# EAGLE design RadioAdapterBoardV4_0 (EAGLE 7.7.0)
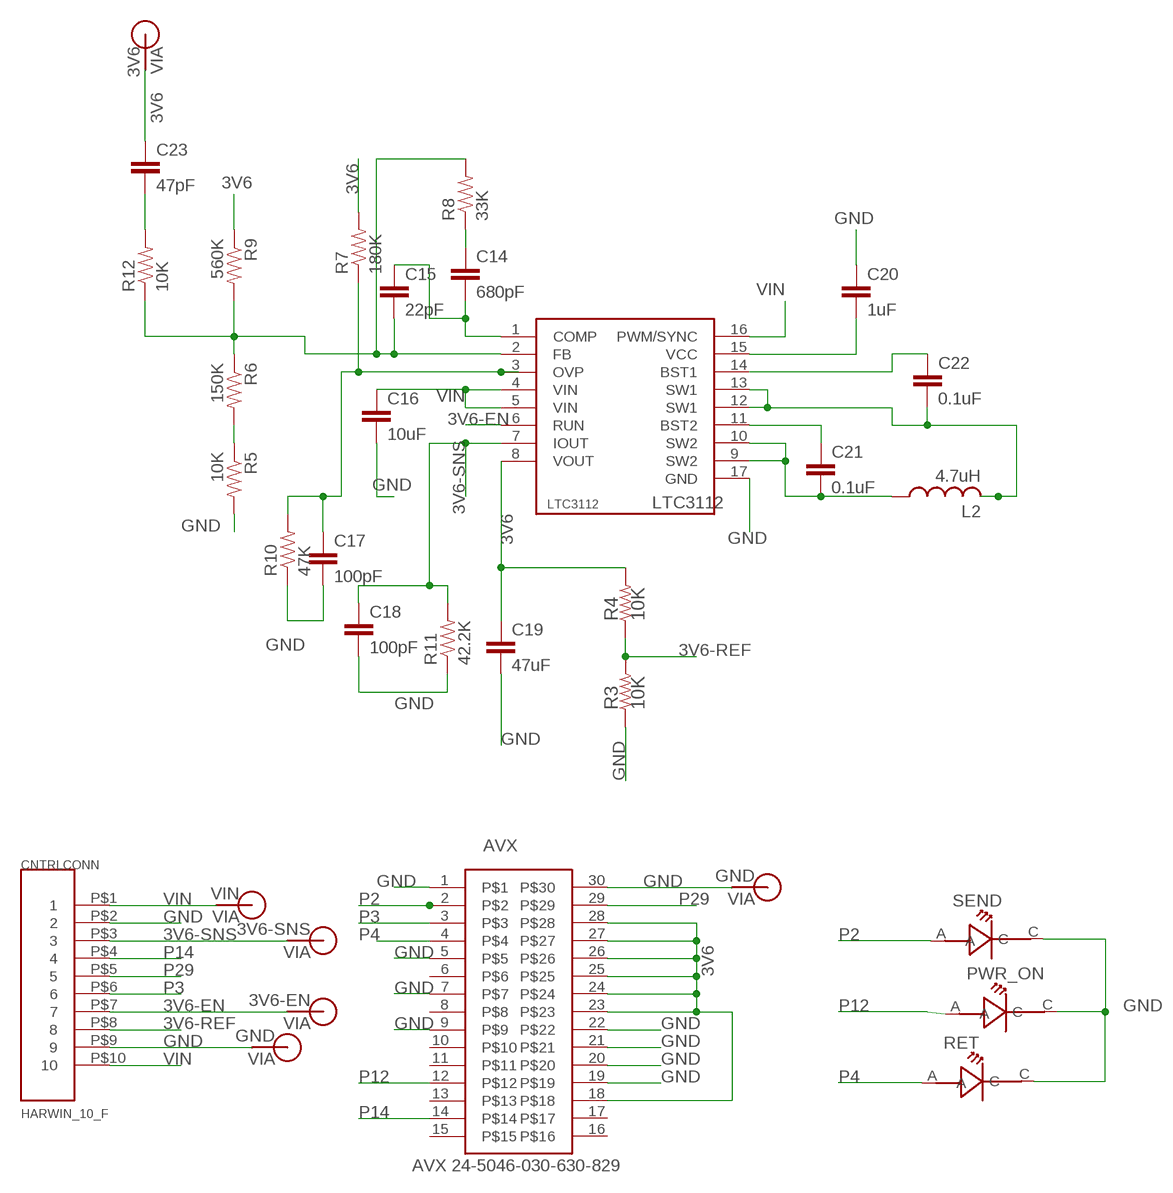
[diagram p0: schematic, sheet 1]

## Parts
AVX  AVX-24-5046-030-630-829  [AVX-24-5046-630-829]
C14  680pF  CAP0805  [0805]
C15  22pF  CAP0805  [0805]
C16  10uF  CAP0805  [0805]
C17  100pF  CAP0805  [0805]
C18  100pF  CAP0805  [0805]
C19  47uF  CAP0805  [0805]
C20  1uF  CAP0805  [0805]
C21  0.1uF  CAP0805  [0805]
C22  0.1uF  CAP0805  [0805]
C23  47pF  CAP0805  [0805]
CNTRLCONN  HARWIN_10_F  [HARWIN_DATAMATE_10_F]
L2  4.7uH  L-USL3225M  [L3225M]
LTC3112  LTC3112  [DHD16]
PWR_ON  LT-T673-Q1R2-25-Z  [PLCC-2]
R3  10K  RES0805  [0805]
R4  10K  RES0805  [0805]
R5  10K  RESISTOR  [0805]
R6  150K  RESISTOR  [0805]
R7  180K  RESISTOR  [0805]
R8  33K  RESISTOR  [0805]
R9  560K  RESISTOR  [0805]
R10  47K  RESISTOR  [0805]
R11  42.2K  RESISTOR  [0805]
R12  10K  RESISTOR  [0805]
RET  LT-T673-Q1R2-25-Z  [PLCC-2]
SEND  LT-T673-Q1R2-25-Z  [PLCC-2]
V1  VIN  VIA60MIL-SQ  [VIA-60MIL-SQ]
V2  3V6-SNS  VIA60MIL-SQ  [VIA-60MIL-SQ]
V3  GND  VIA60MIL-SQ  [VIA-60MIL-SQ]
V4  GND  VIA60MIL-SQ  [VIA-60MIL-SQ]
V5  3V6  VIA60MIL-SQ  [VIA-60MIL-SQ]
V6  3V6-EN  VIA60MIL-SQ  [VIA-60MIL-SQ]

## Nets
3V6: AVX.18 AVX.23 AVX.24 AVX.25 AVX.26 AVX.27 AVX.28 C19.1 C23.1 LTC3112.8(VOUT) R4.2 R7.2 R9.1 V5.P$1
3V6-EN: CNTRLCONN.P$7 LTC3112.6(RUN) V6.P$1
3V6-REF: CNTRLCONN.P$8 R3.2 R4.1
3V6-SNS: C18.1 CNTRLCONN.P$3 LTC3112.7(IOUT) R11.2 V2.P$1
COMP: C14.2 C15.1 LTC3112.1(COMP)
FB: C15.2 LTC3112.2(FB) R6.1 R8.2 R9.2 R12.1
GND: AVX.1 AVX.5 AVX.7 AVX.9 AVX.19 AVX.20 AVX.21 AVX.22 AVX.30 C16.2 C17.2 C18.2 C19.2 C20.1 CNTRLCONN.P$2 CNTRLCONN.P$9 LTC3112.17(GND) PWR_ON.C R3.1 R5.2 R10.1 R11.1 RET.C SEND.C V3.P$1 V4.P$1
N$4: C14.1 R8.1
N$5: C23.2 R12.2
N$6: R5.1 R6.2
N$23: C20.2 LTC3112.15(VCC)
N$25: C22.1 LTC3112.14(BST1)
N$26: C22.2 L2.2 LTC3112.12(SW1) LTC3112.13(SW1)
N$28: C21.2 L2.1 LTC3112.9(SW2) LTC3112.10(SW2)
N$29: C21.1 LTC3112.11(BST2)
OVP: C17.1 LTC3112.3(OVP) R7.1 R10.2
P2: AVX.2 SEND.A
P3: AVX.3 CNTRLCONN.P$6
P4: AVX.4 RET.A
P12: AVX.12 PWR_ON.A
P14: AVX.14 CNTRLCONN.P$4
P29: AVX.29 CNTRLCONN.P$5
VIN: C16.1 CNTRLCONN.P$1 CNTRLCONN.P$10 LTC3112.4(VIN) LTC3112.5(VIN) LTC3112.16(PWM/SYNC) V1.P$1
Unconnected: AVX.6 AVX.8 AVX.10 AVX.11 AVX.13 AVX.15 AVX.16 AVX.17

## Library data of the parts
AVX = CNTRL_BOARD:AVX-24-5046-030-630-829
C14-C23 = CNTRL_BOARD:CAP: Capacitor Standard 0603 ceramic capacitor, and 0.1" leaded capacitor.
CNTRLCONN = CNTRL_BOARD:HARWIN_10_F
L2 = resistor:L-US: INDUCTOR, American symbol
LTC3112 = CNTRL_BOARD:LTC3112
PWR_ON RET SEND = CNTRL_BOARD:LT-T673-Q1R2-25-Z; OC_NEWARK: unknown
R3 R4 = BrownSpaceEngineering:RES
R5-R12 = CNTRL_BOARD:RESISTOR
V1-V6 = BrownSpaceEngineering:VIA

## Board
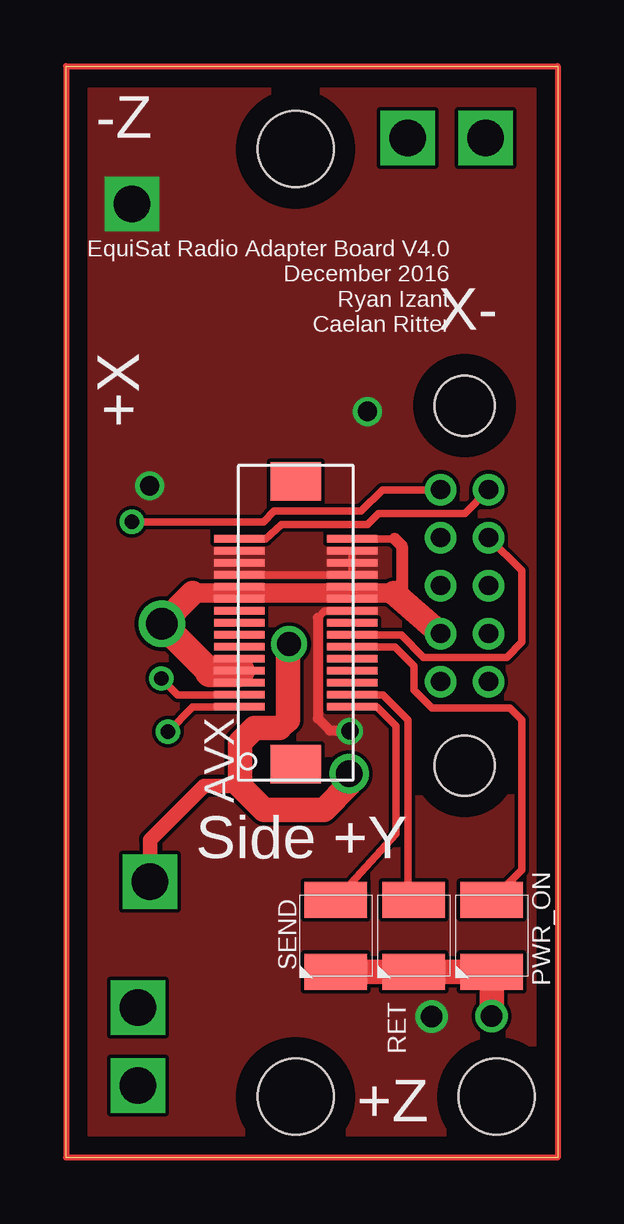
[diagram p1: board, top side]
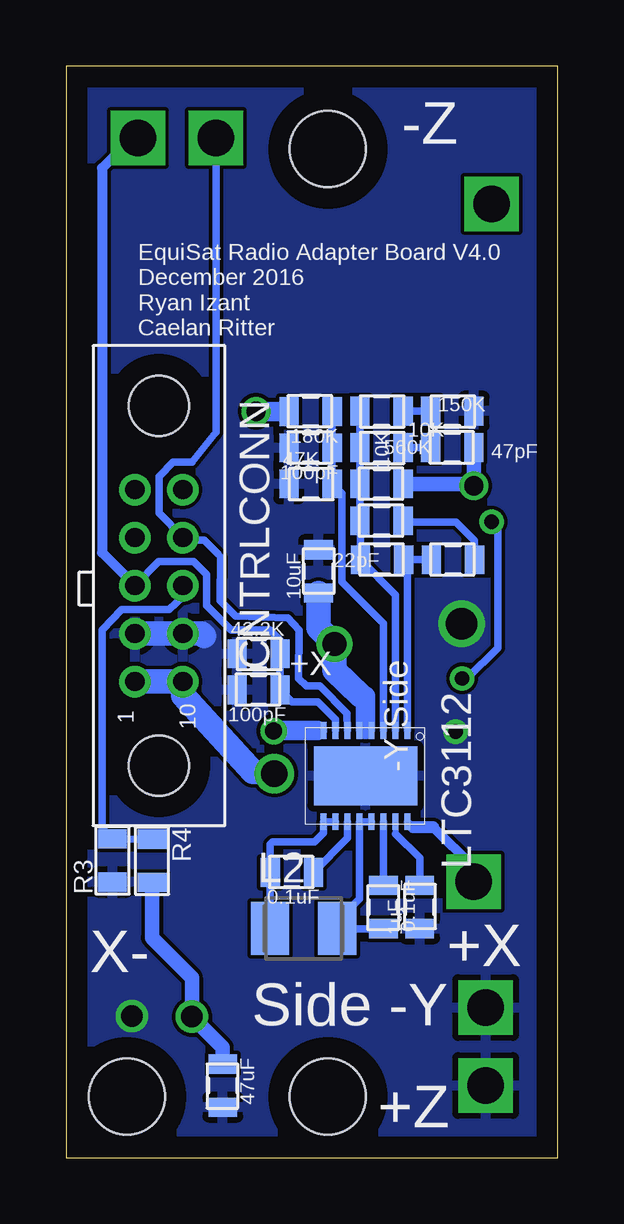
[diagram p2: board, bottom side, seen from below]

Size 20.5 x 45.5 mm. Coordinates in mm from the lower left corner, seen from the top.
Outline: 20.5,0 0,0 0,45.5 20.5,45.5 20.5,0
Copper layers (1*16): Top 0.035mm / dielectric 1.5mm / Bottom 0.035mm
Design rules "default *": minimum track width 10mil, minimum drill 24mil, track to track 6mil, track to pad 6mil, pad to pad 6mil, via to via 6mil, smd to smd 6mil, copper to edge 35mil, drill to drill 8mil, minimum pad ring 10mil, minimum via ring 8mil, stop-mask expansion 4mil, vias tented up to drill 0mil, thermal gap 10mil
Holes 3.18 mm at 17.96,2.54 9.58,2.54 9.58,42.04

### Footprints (pad centres in the part's own frame; a part is rotated, then mirrored left to right if it is on the bottom)
AVX-24-5046-630-829 = smd 0.3 x 2.1: 1 3.5,-2.35; 2 3.5,2.35; 3 3,-2.35; 4 3,2.35; 5 2.5,-2.35; 6 2.5,2.35; 7 2,-2.35; 8 2,2.35; 9 1.5,-2.35; 10 1.5,2.35; 11 1,-2.35; 12 1,2.35; 13 0.5,-2.35; 14 0.5,2.35; 15 0,-2.35; 16 0,2.35; 17 -0.5,-2.35; 18 -0.5,2.35; 19 -1,-2.35; 20 -1,2.35; 21 -1.5,-2.35; 22 -1.5,2.35; 23 -2,-2.35; 24 -2,2.35; 25 -2.5,-2.35; 26 -2.5,2.35; 27 -3,-2.35; 28 -3,2.35; 29 -3.5,-2.35; 30 -3.5,2.35 | smd 1.6 x 2.1: P$31 -5.9,0; P$32 5.9,0
0805 = smd 0.8 x 1.2: 1 -0.9,0; 2 0.9,0
HARWIN_DATAMATE_10_F = drill 0.8: P$1 0,-0.02; P$2 2,-0.02; P$3 4,-0.02; P$4 6,-0.02; P$5 8,-0.02; P$6 8,-2.02; P$7 6,-2.02; P$8 4,-2.02; P$9 2,-2.02; P$10 0,-2.02 | hole 2.5: -3.5,-1.02; 11.5,-1.02
L3225M = smd 1.6 x 2.2: 1 -1.4,0; 2 1.4,0
DHD16 = smd 0.25 x 0.7: 1 0.125,0.35; 2 0.625,0.35; 3 1.125,0.35; 4 1.625,0.35; 5 2.125,0.35; 6 2.638,0.35; 7 3.125,0.35; 8 3.638,0.35; 9 3.625,4.15; 10 3.125,4.15; 11 2.625,4.15; 12 2.125,4.15; 13 1.625,4.15; 14 1.125,4.15; 15 0.625,4.15; 16 0.125,4.15 | smd 4.34 x 2.44: 17 1.875,2.25
PLCC-2 = smd 2.6 x 1.5: A 0,0.75; C 0,-2.25
VIA-60MIL-SQ = drill 1.524 square: P$1 0,0

### Placement (x,y rotation side)
AVX  9.58,22.29 270 top
C14  4.36,24.92 180 bottom
C15  7.32,24.92 180 bottom
C16  9.97,24.43 90 bottom
C17  10.3,29.58 180 bottom
C18  12.47,19.49 180 bottom
C19  13.96,3 270 bottom
C20  5.75,10.44 90 bottom
C21  11.08,11.89 180 bottom
C22  7.26,10.44 270 bottom
C23  4.39,29.59 180 bottom
CNTRLCONN  17.64,19.84 90 bottom
L2  10.59,9.55 0 bottom
LTC3112  6.13,18.15 180 bottom
PWR_ON  17.75,10 0 top
R3  18.56,12.38 90 bottom
R4  16.91,12.37 270 bottom
R5  4.39,31.11 0 bottom
R6  7.34,31.11 0 bottom
R7  10.3,31.1 180 bottom
R8  7.34,26.54 180 bottom
R9  7.34,28.08 180 bottom
R10  10.3,28.08 0 bottom
R11  12.47,21 0 bottom
R12  7.34,29.59 0 bottom
RET  14.5,10 0 top
SEND  11.25,10 0 top
V1  3.5,11.5 0 top
V2  17.5,42.5 180 top
V3  3,3 0 top
V4  3,6.25 0 top
V5  2.75,39.75 180 top
V6  14.25,42.5 0 top

### Tracks (layer width: path | path; a pad name or v marks a point on that pad's centre or on a via)
3V6  (via drill 0.7, 0.8, 0.9)
  Top 0.305: AVX.23 AVX.24 AVX.26 AVX.28 | AVX.18 10.79,22.79 10.5,22.5
  Top 0.406: 10.5,22.5 10.5,18.3 11,17.8 12.07,17.8 v11.84,17.78
  Bottom 0.305: 9.9,17.79 LTC3112.8
  Bottom 0.508: 10.01,17.79 9.9,17.79
  Bottom 0.61: R4.2 16.91,9.16 15.25,7.5 v15.24,5.87 13.96,4.58 C19.1 | R9.1 3.57,28.08 | C23.1 v3.49,28
  Bottom 0.813: 3.57,28.08 v3.49,28 | 10.01,17.79 11.57,17.8 v11.84,17.78 | R7.2 v12.57,31.1
  pour Top (no thermals): -4,48.75 24,48.5 24.5,-1.75 -3.5,-1.5
3V6-EN
  Bottom 0.305: LTC3112.6 8.77,18.51 9.91,19.65 10.47,19.65 10.79,19.96 10.78,22 11.25,22.5 13.43,22.57 14.07,23.23 14.05,25.04 14.15,25.15 14.75,25.75 15.53,25.75 CNTRLCONN.P$7 16.62,26.86 16.62,28.39 16.03,29 15.25,29 14.25,30.25 V6.P$1
3V6-REF
  Bottom 0.305: R4.1 17.92,13.28 R3.2 19,13.72 19,22 18.18,22.84 16.19,22.84 15.62,23.39 CNTRLCONN.P$8
3V6-SNS
  Bottom 0.305: C18.1 R11.2 11.57,21.57 12,22 13.62,22 14.63,23.01 14.63,24.3 15.17,24.84 16.63,24.84 CNTRLCONN.P$3 | 11.29,19.21 C18.1 | LTC3112.7 9.26,18.25 10,19 11.08,19 C18.1
  Bottom 0.406: V2.P$1 17.75,42.5 19,41.25 19,25.22 CNTRLCONN.P$3
COMP
  Bottom 0.305: C14.2 C15.1 6.26,24.75 LTC3112.1
FB
  Bottom 0.305: R6.1 R12.1 R9.2 R8.2 8.22,26.52 C15.2 6.76,23.45 LTC3112.2
GND  (via drill 0.6, 0.9, 1.3)
  Top 0: AVX.5 AVX.7 AVX.9
  Top 0.305: 6.98,23.54 AVX.21 AVX.19 | AVX.30 13.71,25.79 | AVX.22 AVX.20 12,23.53 | AVX.1 5.29,18.79 v4.25,17.75
  Top 0.508: 6.78,23.54 6.98,23.54 | 13.71,25.79 14,25.5 14,23.59 13.69,23.53
  Top 0.813: 6.78,23.54 5.29,23.54 | 13.69,23.53 12,23.53 5.28,23.53
  Top 1.016: SEND.C RET.C PWR_ON.C v17.75,5.9 | 13.69,23.53 CNTRLCONN.P$9 | 5.29,23.54 5.28,23.53 v4,22.25
  Top 1.143: 6,20.25 v4,22.25
  Top 1.27: AVX.7 7.19,20.25 6,20.25
  Bottom 1.016: CNTRLCONN.P$2 14.84,21.84 14.75,21.75
  pour Bottom: -4.25,49 24.25,48.75 24.75,-1.75 -4,-1.75
N$1
  Top 0.25: 20.5,0 0,0 0,45.5 20.5,45.5 20.5,0
N$4
  Bottom 0.305: C14.1 3.46,25.71 4.25,26.5 6.4,26.5 R8.1
N$5
  Bottom 0.305: R12.2 C23.2
N$6
  Bottom 0.305: R6.2 R5.1
N$23
  Bottom 0.254: LTC3112.15 6.76,13.48
  Bottom 0.305: 6.76,13.48 5.75,12.48 C20.2
N$25
  Bottom 0.305: LTC3112.14 C22.1
N$26
  Bottom 0.305: C22.2 L2.2 8.63,10.11 8.63,10.4 8.26,10.78 LTC3112.12 LTC3112.13
N$28
  Bottom 0.305: LTC3112.10 LTC3112.9 9.76,13.53 10.13,13.15 11.88,13.15 11.98,13.05 C21.2 L2.1
N$29
  Bottom 0.305: LTC3112.11 8.76,13.31 C21.1
OVP
  Bottom 0.305: R7.1 C17.1 R10.2 9,27.68 9,24 7.26,22.25 LTC3112.3
P2
  Top 0.305: AVX.2 12.96,18.79 13.75,18 13.75,13.5 SEND.A
P3  (via drill 0.6)
  Top 0.305: AVX.3 4.66,19.29 v3.98,19.97 | v2.75,26.5 8.23,26.5 8.67,26.94 12.31,26.94 13.2,27.83 CNTRLCONN.P$6
  Bottom 0.305: v3.98,19.97 3.78,19.97 2.5,21.25 2.5,26.25 v2.75,26.5
P4
  Top 0.305: AVX.4 13.21,19.29 14.25,18.25 14.25,11 RET.A
P12
  Top 0.305: AVX.12 13.71,21.29 14.5,20.5 14.5,19.5 15.25,18.75 18.5,18.75 19,18.25 19,12 PWR_ON.A
P14
  Top 0.305: AVX.14 13.98,21.79 14.91,20.84 18.38,20.84 19,21.5 19,24.47 CNTRLCONN.P$4
P29
  Top 0.305: AVX.29 8.33,25.79 8.99,26.38 12.57,26.38 13.04,26.84 16.63,26.84 CNTRLCONN.P$5
VIN  (via drill 1, 1.1)
  Top 0.508: 7.25,15.5 6.91,15.5
  Top 0.61: 6.91,15.5 5.75,15.5 3.5,13.25 V1.P$1
  Top 1.016: v11.81,16 11.81,15.56 10.75,14.5 8.25,14.5 7.25,15.5 7.25,17.3 7.87,17.91 8.91,17.91 9.25,18.25 9.25,21.35 v9.31,21.41
  Bottom 0.305: LTC3112.5 LTC3112.4 7.8,17.8 8,18 8.01,17.84 | 6.03,13.77 LTC3112.16
  Bottom 0.406: V1.P$1 3.5,12.09 5.18,13.77
  Bottom 0.508: 5.18,13.77 6.03,13.77
  Bottom 0.813: 8.22,19.26 8,19.25 8.01,17.84
  Bottom 1.016: CNTRLCONN.P$1 CNTRLCONN.P$10 15.62,19.25 12.7,16.08 v11.81,16 | C16.1 9.97,22.07 v9.31,21.41 9.31,20.31 8.22,19.26

### Text on the board
tPlace: EquiSat Radio Adapter Board V4.0 / December 2016 / Ryan Izant / Caelan Ritter
bPlace: EquiSat Radio Adapter Board V4.0 / December 2016 / Ryan Izant / Caelan Ritter | -Y Side | +X
tNames: -Z | -X | +X | Side +Y | +Z
bNames: -Z | +X | -X | Side -Y | +Z